# Altium schematic sheet RS485.SchDoc
size A4
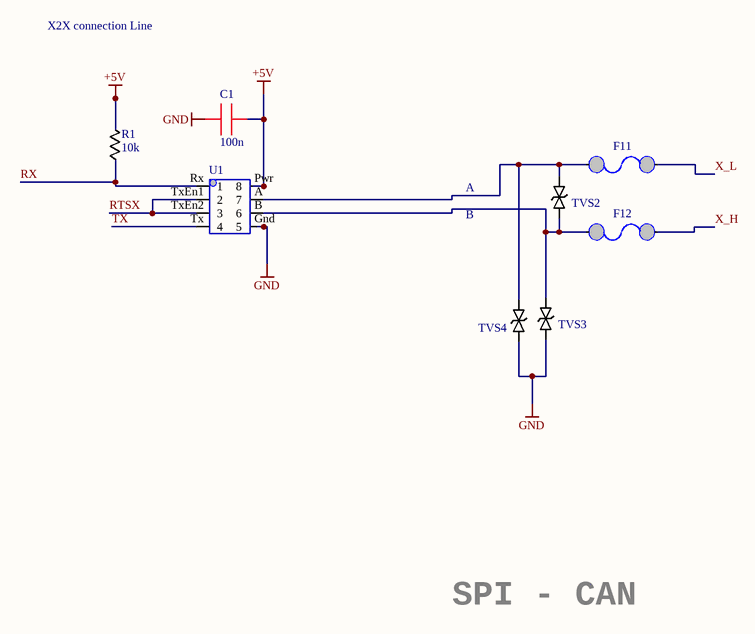
[diagram p0: RS485.SchDoc]

## Parts
C1  100n  [0603_Cap]
F11  (no value)  [1210_MF]
F12  (no value)  [1210_MF]
R1  10k  [0603_Res]
TVS2  (no value)  [DO-214AC]
TVS3  (no value)  [DO-214AC]
TVS4  (no value)  [DO-214AC]
U1  (no value)  [EIA485]

## Nets
+5V: C1.2 R1.2 U1.Pwr(8)
GND: C1.1 TVS3.1 TVS4.1 U1.Gnd(5)
RTSX: U1.TxEn1(2) U1.TxEn2(3)
RX: R1.1 U1.Rx(1)
TX: U1.Tx(4)
X_H: F12.1
X_L: F11.1
NetF11_2: F11.2 TVS2.2 TVS4.2 U1.A(7)
NetF12_2: F12.2 TVS2.1 TVS3.2 U1.B(6)

## Notes on the sheet
- X2X connection Line
- A
- B
- SPI - CAN

## Library data of the parts
C1 = Capasitor 0805: Part Description: Multilayer Ceramic Capacitor 50 V 0.1uF Y5V 0603 -20/+80%; Part Number: CC0603ZRY5V9BB104
F11 F12 = Fuse PTS: Part Description: Resettable Fuses - PPTC 30V 50MA; Part Number: MF-USMF005-2
R1 = Resistor 0805: Part Description: Thin Film Resistors - SMD 10K ohm 1% 1/10W; Part Number: RT0603FRE0710KL
TVS2-TVS4 = SMAJ5.0CA: Part Description: ESD Protection Diodes 5volts 800/1600uA 43.5 Amps Bi-Dir; Part Number: SMAJ5.0CA
U1 = MAX485: Part Description: RS-485 Interface IC Low-Power; Part Number: SN65HVD3082EDR